# EAGLE schematic AM512B (EAGLE 6.4)
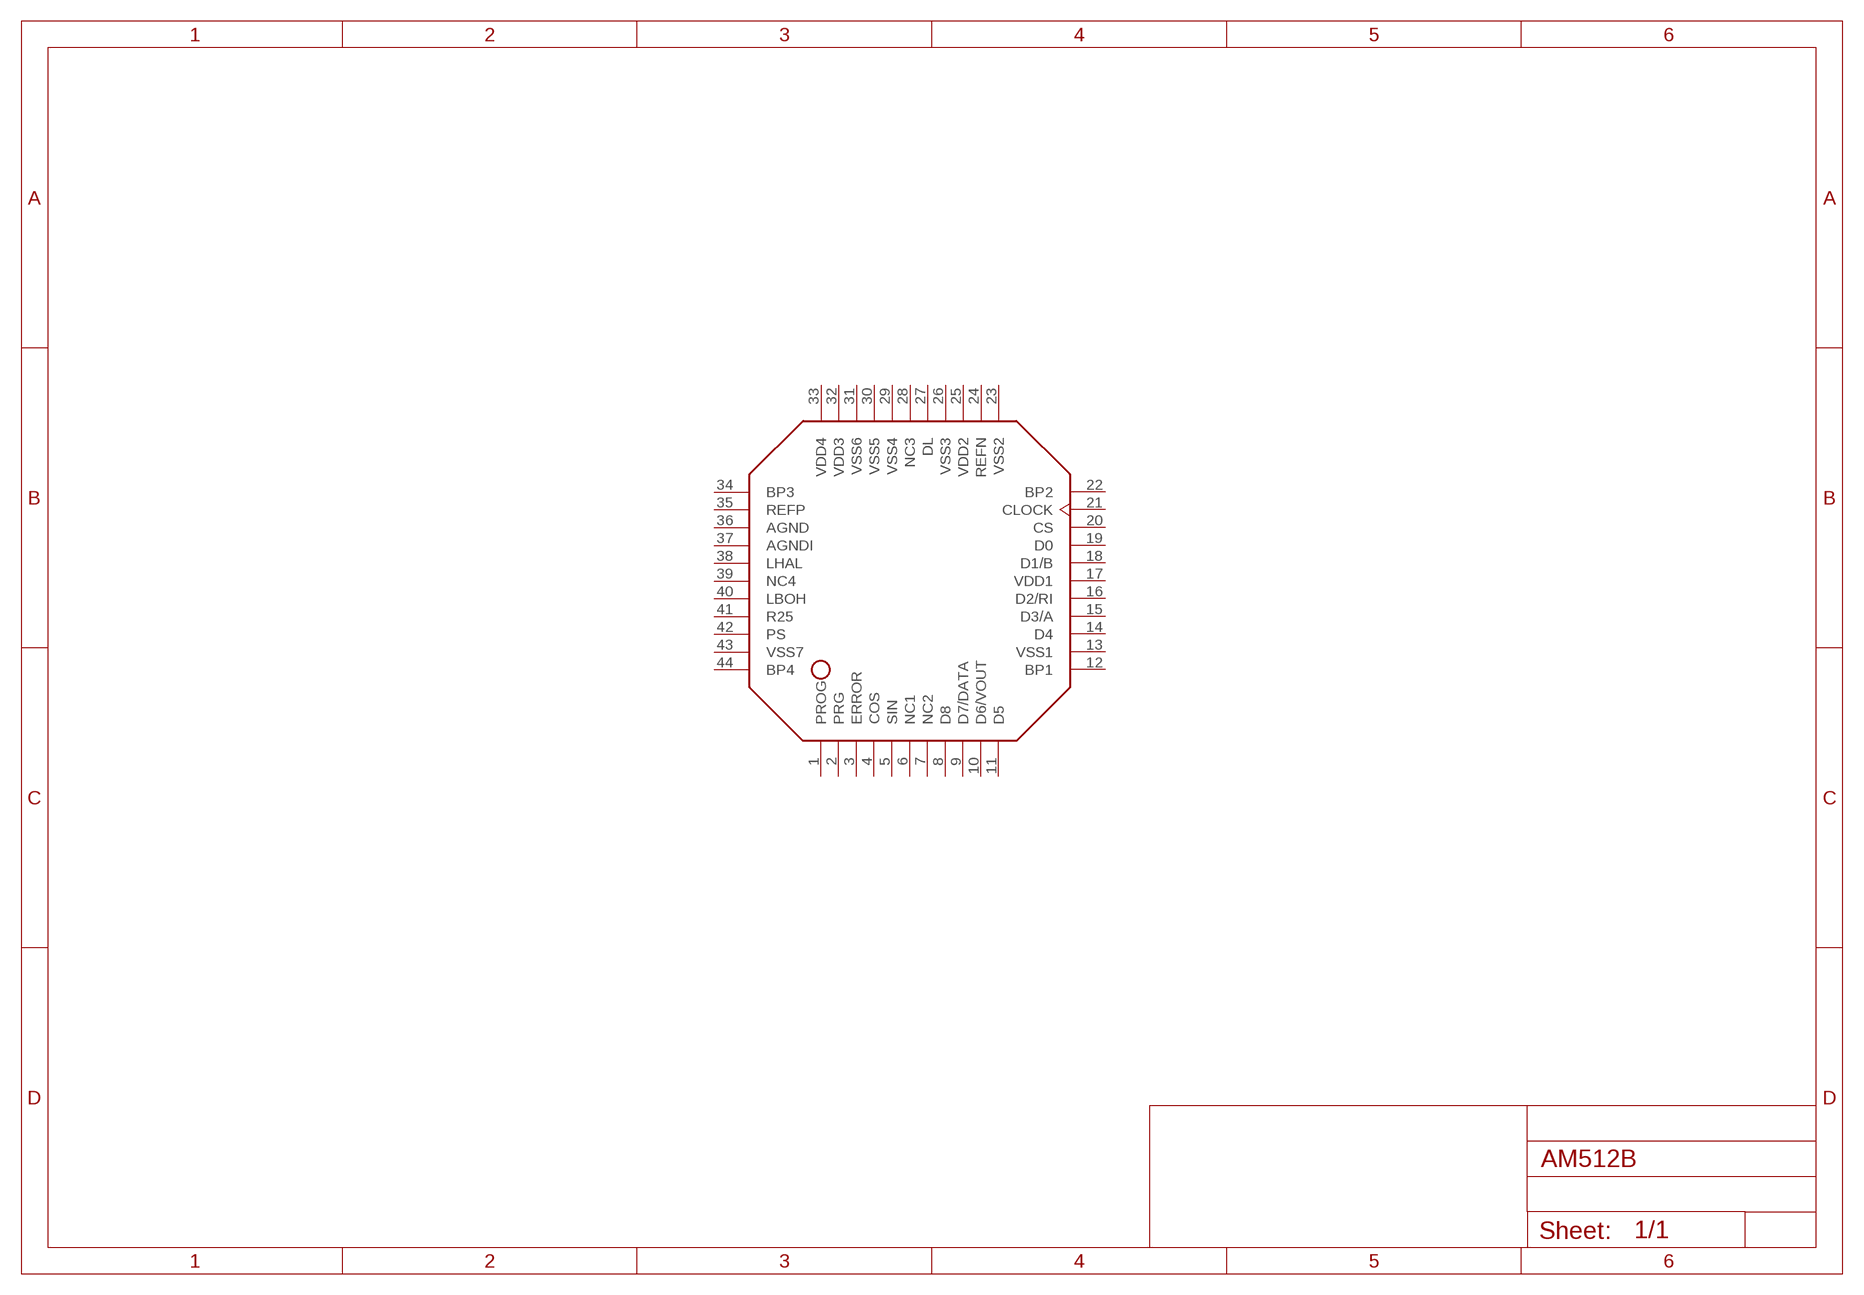
[diagram p0: schematic, sheet 1]

## Parts
IC1  AM512BLQFP44  [TQFP44-SOT376-1]
Unconnected: IC1.1(PROG) IC1.2(PRG) IC1.3(ERROR) IC1.4(COS) IC1.5(SIN) IC1.6(NC1) IC1.7(NC2) IC1.8(D8) IC1.9(D7/DATA) IC1.10(D6/VOUT) IC1.11(D5) IC1.14(D4) IC1.15(D3/A) IC1.16(D2/RI) IC1.18(D1/B) IC1.19(D0) IC1.20(CS) IC1.21(CLOCK) IC1.24(REFN) IC1.27(DL) IC1.28(NC3) IC1.35(REFP) IC1.38(LHAL) IC1.39(NC4) IC1.40(LBOH) IC1.41(R25) IC1.42(PS)

## Power pins joined to a net without a drawn wire
AGND: IC1.36(AGND)
AGNDI: IC1.37(AGNDI)
BP1: IC1.12(BP1)
BP2: IC1.22(BP2)
BP3: IC1.34(BP3)
BP4: IC1.44(BP4)
VDD1: IC1.17(VDD1)
VDD2: IC1.25(VDD2)
VDD3: IC1.32(VDD3)
VDD4: IC1.33(VDD4)
VSS1: IC1.13(VSS1)
VSS2: IC1.23(VSS2)
VSS3: IC1.26(VSS3)
VSS4: IC1.29(VSS4)
VSS5: IC1.30(VSS5)
VSS6: IC1.31(VSS6)
VSS7: IC1.43(VSS7)

## Library data of the parts
IC1 = encoder:AM512B